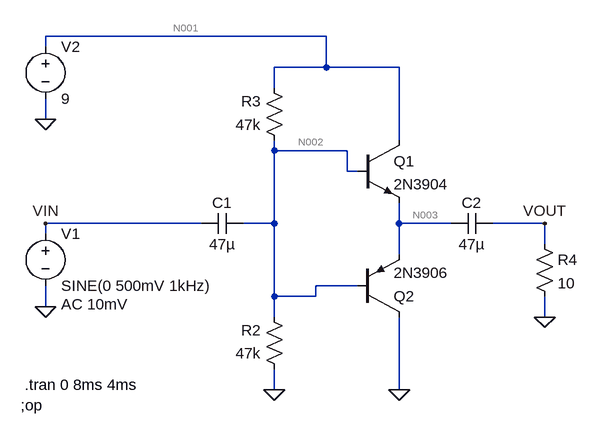
[diagram p0: schematic Figure_3.10.asc]
Figure_3.10.asc, the LTspice schematic file:
Version 4
SHEET 1 880 680
WIRE 240 -128 -192 -128
WIRE -192 -112 -192 -128
WIRE 240 -80 240 -128
WIRE 240 -80 160 -80
WIRE 352 -80 240 -80
WIRE 160 -48 160 -80
WIRE -192 0 -192 -32
WIRE 352 32 352 -80
WIRE 160 48 160 32
WIRE 272 48 160 48
WIRE 272 80 272 48
WIRE 288 80 272 80
WIRE 48 160 -192 160
WIRE 160 160 160 48
WIRE 160 160 112 160
WIRE 352 160 352 128
WIRE 432 160 352 160
WIRE 576 160 496 160
WIRE -192 176 -192 160
WIRE 576 192 576 160
WIRE 352 208 352 160
WIRE 288 256 224 256
WIRE 160 272 160 160
WIRE 224 272 224 256
WIRE 224 272 160 272
WIRE -192 288 -192 256
WIRE 160 304 160 272
WIRE 576 304 576 272
WIRE 160 416 160 384
WIRE 352 416 352 304
FLAG 576 304 0
FLAG 160 416 0
FLAG 352 416 0
FLAG -192 288 0
FLAG 576 160 VOUT
FLAG -192 160 VIN
FLAG -192 0 0
SYMBOL cap 112 144 R90
WINDOW 0 0 32 VBottom 2
WINDOW 3 32 32 VTop 2
SYMATTR InstName C1
SYMATTR Value 47µ
SYMBOL res 176 400 R180
WINDOW 0 36 76 Left 2
WINDOW 3 36 40 Left 2
SYMATTR InstName R2
SYMATTR Value 47k
SYMBOL res 176 48 R180
WINDOW 0 36 76 Left 2
WINDOW 3 36 40 Left 2
SYMATTR InstName R3
SYMATTR Value 47k
SYMBOL npn 288 32 R0
SYMATTR InstName Q1
SYMATTR Value 2N3904
SYMBOL pnp 288 304 M180
SYMATTR InstName Q2
SYMATTR Value 2N3906
SYMBOL cap 496 144 R90
WINDOW 0 0 32 VBottom 2
WINDOW 3 32 32 VTop 2
SYMATTR InstName C2
SYMATTR Value 47µ
SYMBOL res 560 176 R0
SYMATTR InstName R4
SYMATTR Value 10
SYMBOL voltage -192 160 R0
WINDOW 123 24 124 Left 2
WINDOW 39 0 0 Left 2
SYMATTR InstName V1
SYMATTR Value SINE(0 500mV 1kHz)
SYMATTR Value2 AC 10mV
SYMBOL voltage -192 -128 R0
WINDOW 123 0 0 Left 2
WINDOW 39 0 0 Left 2
SYMATTR InstName V2
SYMATTR Value 9
TEXT -230 440 Left 2 !;op
TEXT -224 408 Left 2 !.tran 0 8ms 4ms

The netlist it stands for:
* Figure_3.10.asc
C1 N002 VIN 47µ
R2 0 N002 47k
R3 N002 N001 47k
Q1 N001 N002 N003 0 2N3904
Q2 0 N002 N003 0 2N3906
C2 VOUT N003 47µ
R4 VOUT 0 10
V1 VIN 0 SINE(0 500mV 1kHz) AC 10mV
V2 N001 0 9
.model NPN NPN
.model PNP PNP
.lib standard.bjt
;op
.tran 0 8ms 4ms
.backanno
.end

* Results of the author's LTspice run, read from the files saved beside the schematic
* Operating Point, zero values left out:
*   V(n002) = 4.5 V
*   V(n001) = 9 V
*   V(n003) = 4.499 V
*   Ic(Q2) = -4.512 pA
*   Ib(Q2) = 4.504 pA
*   Ic(Q1) = 13.52 pA
*   Ib(Q1) = -4.501 pA
*   I(R3) = -95.74 µA
*   I(R2) = -95.74 µA
*   I(V2) = -95.74 µA
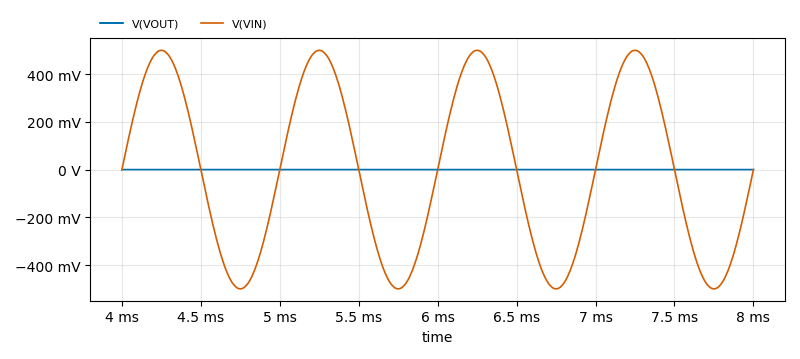
[diagram p1: Transient Analysis of Figure_3.10.asc, plotted from the saved traces]
* Transient Analysis, 1 run:
*   V(VOUT): min -24.43 µV, max 26.56 µV, average 198.2 nV, rms 9.283 µV, last 565.4 nV
*   V(VIN): min -499.5 mV, max 499.5 mV, average -915.2 nV, rms 353.6 mV, last 0 V